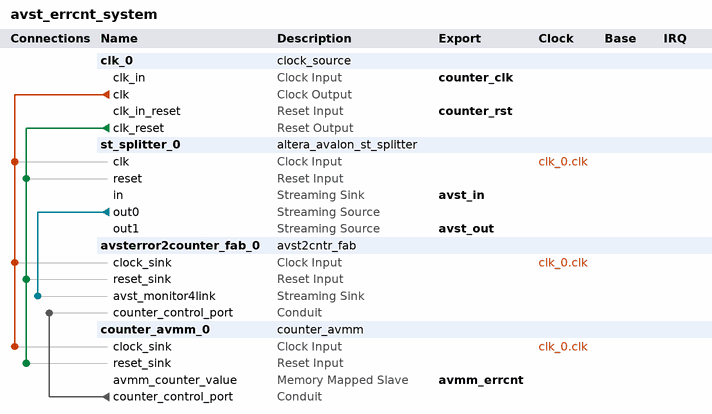
[diagram p0: system contents]
# Platform Designer (Qsys) system avst_errcnt_system, Arria V 5AGXBA7D4F31C5
# Parameters at their usual value, and those the tool derives, are not listed.
package require -exact qsys 18.1
create_system avst_errcnt_system
set_project_property DEVICE_FAMILY {Arria V}
set_project_property DEVICE 5AGXBA7D4F31C5

add_instance clk_0 clock_source 18.1
set_instance_parameter_value clk_0 clockFrequency 125000000
set_instance_parameter_value clk_0 resetSynchronousEdges DEASSERT

add_instance st_splitter_0 altera_avalon_st_splitter 18.1
set_instance_parameter_value st_splitter_0 BITS_PER_SYMBOL 9
set_instance_parameter_value st_splitter_0 CHANNEL_WIDTH 3
set_instance_parameter_value st_splitter_0 DATA_WIDTH 9
set_instance_parameter_value st_splitter_0 ERROR_WIDTH 3
set_instance_parameter_value st_splitter_0 MAX_CHANNELS 7
set_instance_parameter_value st_splitter_0 NUMBER_OF_OUTPUTS 2
set_instance_parameter_value st_splitter_0 QUALIFY_VALID_OUT 1
set_instance_parameter_value st_splitter_0 READY_LATENCY 0
set_instance_parameter_value st_splitter_0 USE_CHANNEL 1
set_instance_parameter_value st_splitter_0 USE_DATA 1
set_instance_parameter_value st_splitter_0 USE_ERROR 1
set_instance_parameter_value st_splitter_0 USE_PACKETS 0
set_instance_parameter_value st_splitter_0 USE_READY 0
set_instance_parameter_value st_splitter_0 USE_VALID 1

add_instance avsterror2counter_fab_0 avst2cntr_fab 1.0.5
set_instance_parameter_value avsterror2counter_fab_0 DEBUG 1
set_instance_parameter_value avsterror2counter_fab_0 EN_LOGIC OR
set_instance_parameter_value avsterror2counter_fab_0 ERR_MASK 1
set_instance_parameter_value avsterror2counter_fab_0 ST_CH_W 3
set_instance_parameter_value avsterror2counter_fab_0 ST_DATA_W 9
set_instance_parameter_value avsterror2counter_fab_0 ST_ERR_W 3

add_instance counter_avmm_0 counter_avmm 1.4.1
set_instance_parameter_value counter_avmm_0 ADDR_W 1
set_instance_parameter_value counter_avmm_0 COUNTER_BITS 31
set_instance_parameter_value counter_avmm_0 N_COUNTER 1
set_instance_parameter_value counter_avmm_0 READ_ON_THE_FLY true
set_instance_parameter_value counter_avmm_0 USE_TOP_BIT_AS_OF_FLAG 1

# connections
add_connection clk_0.clk avsterror2counter_fab_0.clock_sink clock
add_connection clk_0.clk counter_avmm_0.clock_sink clock
add_connection clk_0.clk st_splitter_0.clk clock
add_connection clk_0.clk_reset avsterror2counter_fab_0.reset_sink reset
add_connection clk_0.clk_reset counter_avmm_0.reset_sink reset
add_connection clk_0.clk_reset st_splitter_0.reset reset
add_connection st_splitter_0.out0 avsterror2counter_fab_0.avst_monitor4link avalon_streaming
add_connection counter_avmm_0.counter_control_port avsterror2counter_fab_0.counter_control_port conduit

# exported interfaces
add_interface avmm_errcnt avalon slave
set_interface_property avmm_errcnt EXPORT_OF counter_avmm_0.avmm_counter_value
add_interface avst_in avalon_streaming sink
set_interface_property avst_in EXPORT_OF st_splitter_0.in
add_interface avst_out avalon_streaming source
set_interface_property avst_out EXPORT_OF st_splitter_0.out1
add_interface counter_clk clock sink
set_interface_property counter_clk EXPORT_OF clk_0.clk_in
add_interface counter_rst reset sink
set_interface_property counter_rst EXPORT_OF clk_0.clk_in_reset

set_interconnect_requirement {$system} qsys_mm.clockCrossingAdapter HANDSHAKE
set_interconnect_requirement {$system} qsys_mm.enableEccProtection FALSE
set_interconnect_requirement {$system} qsys_mm.insertDefaultSlave FALSE
set_interconnect_requirement {$system} qsys_mm.maxAdditionalLatency 1

save_system avst_errcnt_system.qsys
